# Altium schematic sheet 1_Sheet_1.schdoc.schdoc
size 302 x 215 mm; Name: A_A4; Symbol: A_A4; Device: A_A4; @Project Name: Arduino Spot welder_2024-04-27_21-11-09; REV: 1.0; Date: 2021-09-07; Sheet: 1/1; Draw By: Nischal Poudel; Company: Amateur Inventor; Convert to PCB: yes; Add into BOM: yes
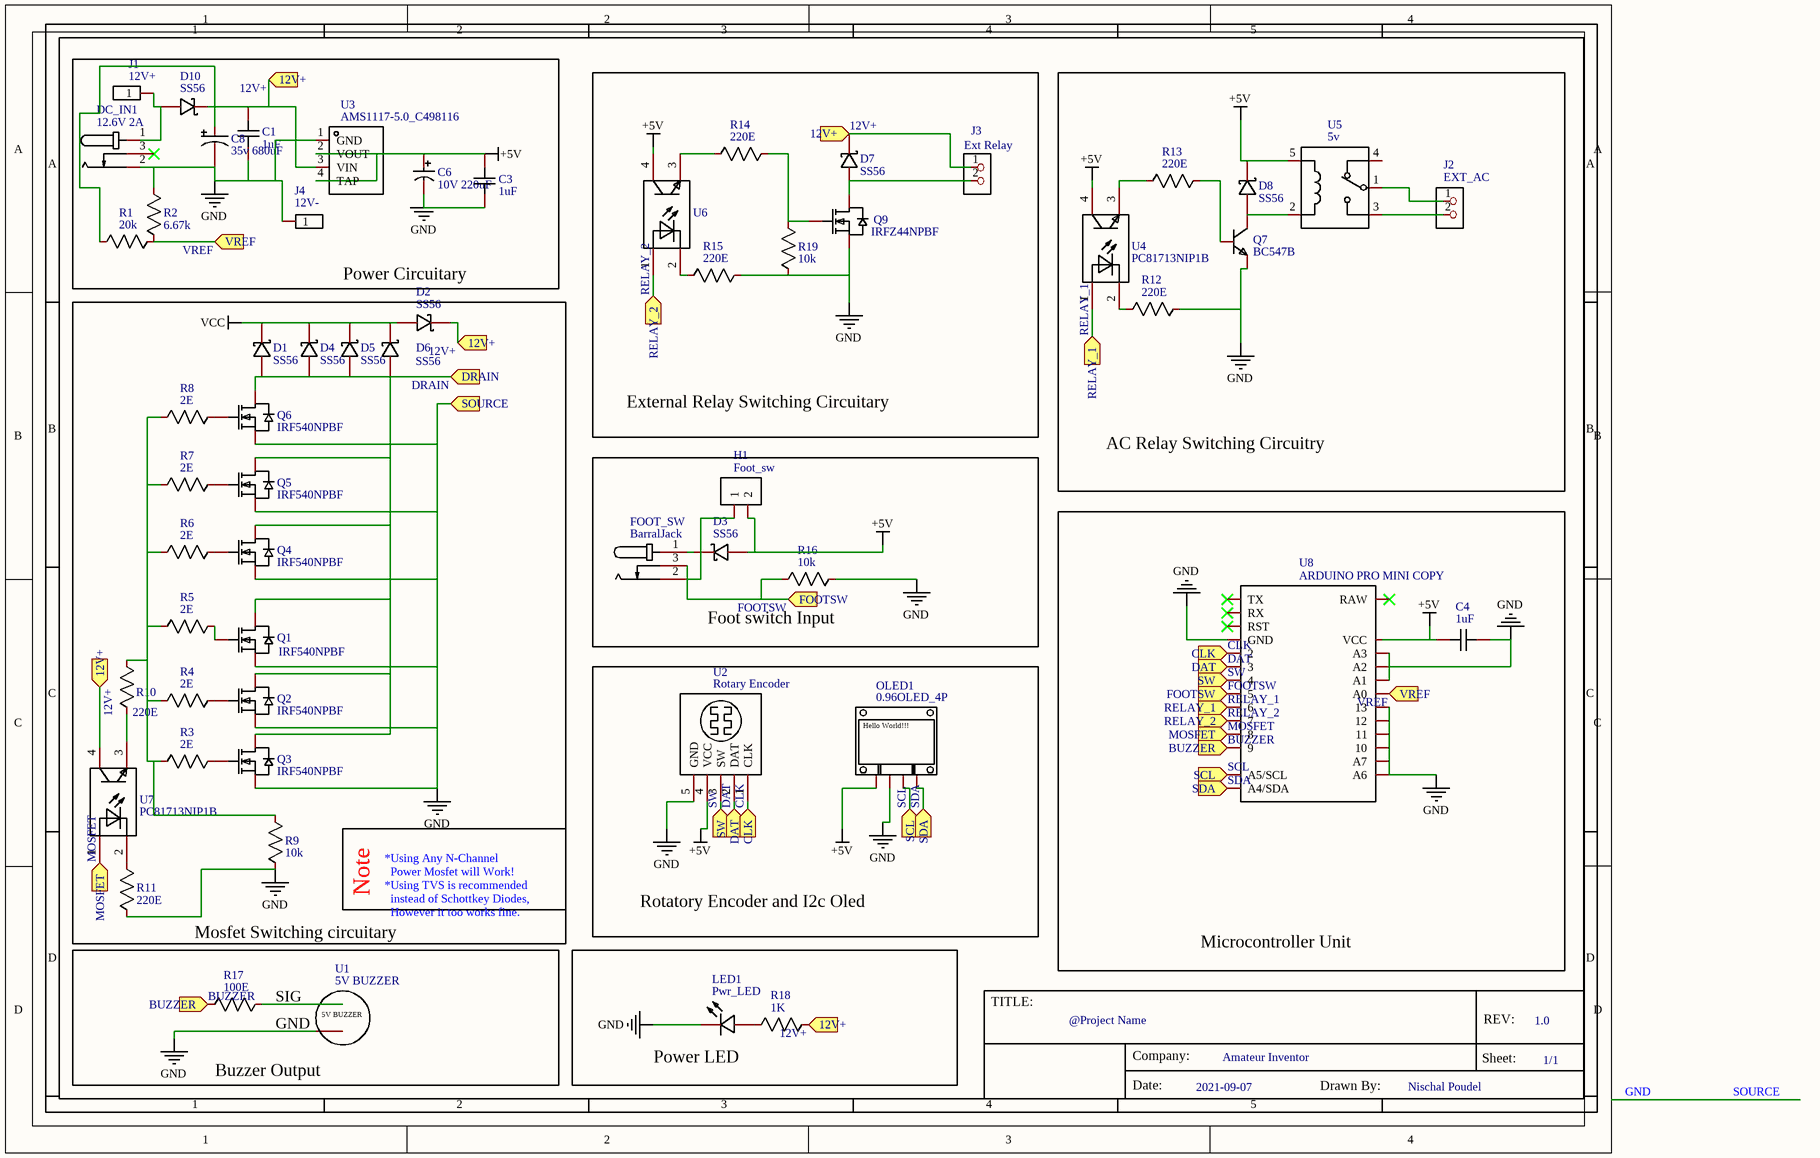
[diagram p0: 1_Sheet_1.schdoc.schdoc]

## Parts
C1  1uF  [footprint_bc1e]
C3  1uF  [footprint_bc1e]
C4  1uF  [footprint_bc1e]
C6  10V 220uF  [footprint_28fa]
C8  35v 680uF  [footprint_2c7b]
D1  SS56  [footprint_9b9f]
D2  SS56  [footprint_9b9f]
D3  SS56  [footprint_9b9f]
D4  SS56  [footprint_9b9f]
D5  SS56  [footprint_9b9f]
D6  SS56  [footprint_9b9f]
D7  SS56  [footprint_9b9f]
D8  SS56  [footprint_9b9f]
D10  SS56  [footprint_9b9f]
DC_IN1  12.6V 2A  [footprint_4f4c]
FOOT_SW  BarralJack  [footprint_4f4c]
H1  Foot_sw  [footprint_42ee]
J1  12V+  [footprint_73cd]
J2  EXT_AC  [footprint_047e]
J3  Ext Relay  [footprint_047e]
J4  12V-  [footprint_73cd]
LED1  Pwr_LED  [footprint_213e]
OLED1  0.96OLED_4P  [footprint_7381]
Q1  IRF540NPBF  [footprint_fbe3]
Q2  IRF540NPBF  [footprint_fbe3]
Q3  IRF540NPBF  [footprint_fbe3]
Q4  IRF540NPBF  [footprint_fbe3]
Q5  IRF540NPBF  [footprint_fbe3]
Q6  IRF540NPBF  [footprint_fbe3]
Q7  BC547B  [footprint_6e3f]
Q9  IRFZ44NPBF  [footprint_beaa]
R1  20k  [footprint_e60d]
R2  6.67k  [footprint_e60d]
R3  2E  [footprint_e60d]
R4  2E  [footprint_e60d]
R5  2E  [footprint_e60d]
R6  2E  [footprint_e60d]
R7  2E  [footprint_e60d]
R8  2E  [footprint_e60d]
R9  10k  [footprint_e60d]
R10  220E  [footprint_e60d]
R11  220E  [footprint_e60d]
R12  220E  [footprint_e60d]
R13  220E  [footprint_e60d]
R14  220E  [footprint_e60d]
R15  220E  [footprint_e60d]
R16  10k  [footprint_e60d]
R17  100E  [footprint_e60d]
R18  1K  [footprint_e60d]
R19  10k  [footprint_e60d]
U1  5V BUZZER  [footprint_9d75]
U2  Rotary Encoder  [footprint_7133]
U3  AMS1117-5.0_C498116  [footprint_729b]
U4  PC81713NIP1B  [footprint_04e3]
U5  5v  [footprint_572f]
U6  PC81713NIP1B  [footprint_04e3]  (value not drawn)
U7  PC81713NIP1B  [footprint_04e3]
U8  ARDUINO PRO MINI COPY  [footprint_e3e4]

## Ports
12V+ (in), BUZZER (in), CLK (in), DAT (in), DRAIN (in), FOOTSW (in), MOSFET (in), RELAY_1 (in), RELAY_2 (in), SCL (in), SDA (in), SOURCE (in), SW (in), VREF (in)

## Nets
+5V: C3.2 C4.2 C6.1 D3.2 D8.1 H1.2 OLED1.1 U2.4(VCC) U3.2(VOUT) U3.4(TAP) U4.4(Collector) U5.5 U6.4(Collector) U8.VCC
GND: C1.1 C3.1 C4.1 C6.2 C8.2 DC_IN1.2 J4.1 LED1.1(-) OLED1.2 Q1.3(S) Q2.3(S) Q3.3(S) Q4.3(S) Q5.3(S) Q6.3(S) Q7.3(E) Q9.3(S) R2.1 R9.1 R11.1 R12.1 R15.1 R16.1 R19.2 U2.5(GND) U3.1(GND) U8.A1 U8.A2 U8.A3 U8.A6 U8.A7 U8.D10(10) U8.D11(11) U8.D12(12) U8.D13(13) U8.GND ; port SOURCE  [also labelled SOURCE]
VCC: D1.1 D2.2 D4.1 D5.1 D6.1
12V+: C1.2 C8.1 D2.1 D7.1 D10.1 J3.1 R1.1 R18.1 U3.3(VIN) U7.4(Collector) ; port 12V+
BUZZER: R17.2 U8.D9(9) ; port BUZZER
CLK: U2.1(CLK) U8.D2(2) ; port CLK
DAT: U2.2(DAT) U8.D3(3) ; port DAT
DRAIN: D1.2 D4.2 D5.2 D6.2 Q1.2(D) Q2.2(D) Q3.2(D) Q4.2(D) Q5.2(D) Q6.2(D) ; port DRAIN
FOOTSW: FOOT_SW.2 FOOT_SW.3 H1.1 R16.2 U8.D5(5) ; port FOOTSW
MOSFET: U7.1(Anode) U8.D8(8) ; port MOSFET
RELAY_1: U4.1(Anode) U8.D6(6) ; port RELAY_1
RELAY_2: U6.1(Anode) U8.D7(7) ; port RELAY_2
SCL: OLED1.3 U8.A5(A5/SCL) ; port SCL
SDA: OLED1.4 U8.A4(A4/SDA) ; port SDA
SW: U2.3(SW) U8.D4(4) ; port SW
VREF: R1.2 R2.2 U8.A0 ; port VREF
NetD3_1: D3.1 FOOT_SW.1
NetD7_2: D7.2 J3.2 Q9.2(D)
NetD8_2: D8.2 Q7.1(C) U5.2
NetD10_2: D10.2 DC_IN1.1 J1.1
NetJ2_1: J2.1 U5.1
NetJ2_2: J2.2 U5.3
NetLED1_2: LED1.2(+) R18.2
NetQ1_1: Q1.1(G) R5.2
NetQ2_1: Q2.1(G) R4.2
NetQ3_1: Q3.1(G) R3.2
NetQ4_1: Q4.1(G) R6.2
NetQ5_1: Q5.1(G) R7.2
NetQ6_1: Q6.1(G) R8.2
NetQ7_2: Q7.2(B) R13.2
NetQ9_1: Q9.1(G) R14.2 R19.1
NetR3_1: R3.1 R4.1 R5.1 R6.1 R7.1 R8.1 R9.2 R10.2
NetR10_1: R10.1 U7.3(Emitter)
NetR11_2: R11.2 U7.2(Cathode)
NetR12_2: R12.2 U4.2(Cathode)
NetR13_1: R13.1 U4.3(Emitter)
NetR14_1: R14.1 U6.3(Emitter)
NetR15_2: R15.2 U6.2(Cathode)
NetR17_1: R17.1 U1.1

Not connected (* = marked no-connect by the designer): DC_IN1 3*; U1 2; U5 4; U8 RAW* RST* RX* TX*

## Notes on the sheet
- 1
- 2
- 3
- 4
- 5
- A
- B
- C
- D
- TITLE:
- @Project Name
- REV:
- 1.0
- Date:
- Company:
- 2021-09-07
- Amateur Inventor
- Drawn By:
- Nischal Poudel
- Sheet:
- 1/1
- (in symbol 0.96OLED_4P) Hello World!!!
- (in symbol 5V BUZZER) SIG; GND
- (in symbol ARDUINO PRO MINI COPY) Power Circuitary; External Relay Switching Circuitary; AC Relay Switching Circuitry; Foot switch Input; *Using Any N-Channel / Power Mosfet will Work!; *Using TVS is recommended / instead of Schottkey Diodes, / However it too works fine.; Note; Rotatory Encoder and I2c Oled; Mosfet Switching circuitary; Microcontroller Unit; Power LED; Buzzer Output

## Library data of the parts
C1 C3 C4 = 0603B105K160NT: Manufacturer: FH; Convert to PCB: yes; Origin Footprint: C0603; Name: 1uF; Symbol: 1uF; Device: 0603B105K160NT; Supplier: LCSC; Manufacturer Part: 0603B105K160NT; Supplier Part: C93816; Add into BOM: yes
C6 = 220uF 10V black gold 5*11: Manufacturer: ValuePro; Convert to PCB: yes; Origin Footprint: CAP-TH_BD5.0-P2.00-D0.8-FD; Name: 10V 220uF; Symbol: 10V 220uF; Device: 220uF 10V black gold 5*11; Supplier: LCSC; Manufacturer Part: 220uF 10V black gold 5*11; Supplier Part: C43355; JLCPCB Part Class: Extended Part; Add into BOM: yes
C8 = RC035M681LO10*16TH-2A1E: Manufacturer: BERYL Electronic Tech; Convert to PCB: yes; Origin Footprint: CAP-TH_BD10.0-P5.00-D1.0-FD; Name: 35v 680uF; Symbol: 35v 680uF; Device: RC035M681LO10*16TH-2A1E; Supplier: LCSC; Supplier Part: C357636; Manufacturer Part: RC035M681LO10*16TH-2A1E; JLCPCB Part Class: Extended Part; Add into BOM: yes
D1-D8 D10 = SS56: Manufacturer: High Diode; Convert to PCB: yes; Origin Footprint: SMA_L4.4-W2.6-LS5.0-RD; Name: SS56; Symbol: SS56; Device: SS56; Supplier: LCSC; Supplier Part: C466505; Manufacturer Part: SS56; Add into BOM: yes
DC_IN1 = DC-005B-2.5A-2.0: Manufacturer: XKB Enterprise; Convert to PCB: yes; Origin Footprint: DC-IN-TH_DC-005-20A; Name: 12.6V 2A; Symbol: 12.6V 2A; Device: DC-005B-2.5A-2.0; Supplier: LCSC; Supplier Part: C319132; Manufacturer Part: DC-005B-2.5A-2.0; JLCPCB Part Class: Extended Part; Add into BOM: yes
FOOT_SW = DC-005B-2.5A-2.0: Manufacturer: XKB Enterprise; Symbol: 12.6V 2A; Convert to PCB: yes; Origin Footprint: DC-IN-TH_DC-005-20A; Name: BarralJack; Device: DC-005B-2.5A-2.0; Supplier: LCSC; Supplier Part: C319132; Manufacturer Part: DC-005B-2.5A-2.0; JLCPCB Part Class: Extended Part; Add into BOM: yes
H1 = Foot_sw: Convert to PCB: yes; Origin Footprint: HDR-F-2.54_1X2; Name: Foot_sw; Symbol: Foot_sw; Device: Foot_sw; Supplier Part: C49661; Supplier: LCSC; Add into BOM: yes
J1 = 12V+: Convert to PCB: yes; Origin Footprint: HDR-M-2.54_1X1; Name: 12V+; Symbol: 12V+; Device: 12V+; Supplier Part: C81276; Supplier: LCSC; Add into BOM: yes
J2 = EXT_AC: Convert to PCB: yes; Origin Footprint: TERMINAL_BLOCK_2P_5; Name: EXT_AC; Symbol: EXT_AC; Device: EXT_AC; Add into BOM: yes
J3 = Ext Relay: Convert to PCB: yes; Origin Footprint: TERMINAL_BLOCK_2P_5; Name: Ext Relay; Symbol: Ext Relay; Device: Ext Relay; Add into BOM: yes
J4 = 12V-: Convert to PCB: yes; Origin Footprint: HDR-M-2.54_1X1; Name: 12V-; Symbol: 12V-; Device: 12V-; Supplier Part: C81276; Supplier: LCSC; Add into BOM: yes
LED1 = TJ-S1608SW6TGLC2G-A5: Manufacturer: TOGIALED; Convert to PCB: yes; Origin Footprint: LED0603-RD; Name: Pwr_LED; Symbol: Pwr_LED; Device: TJ-S1608SW6TGLC2G-A5; Supplier: LCSC; Supplier Part: C192316; Manufacturer Part: TJ-S1608SW6TGLC2G-A5; JLCPCB Part Class: Extended Part; Add into BOM: yes
OLED1 = 0.96OLED_4P: Convert to PCB: yes; Name: 0.96OLED_4P; Symbol: 0.96OLED_4P; Device: 0.96OLED_4P; Supplier: LCSC; Add into BOM: yes; Origin Footprint: 0.96OLED_4P
Q1-Q6 = IRF540NPBF: Manufacturer: Infineon; Convert to PCB: yes; Origin Footprint: TO-220-3_L10.0-W4.5-P2.54-L; Name: IRF540NPBF; Symbol: IRF540NPBF; Device: IRF540NPBF; Supplier: LCSC; Manufacturer Part: IRF540NPBF; Supplier Part: C2566; JLCPCB Part Class: Extended Part; Add into BOM: yes
Q7 = BC547B: Manufacturer: LGE; Convert to PCB: yes; Origin Footprint: TO-92-3_L4.9-W3.7-P1.27-L; Name: BC547B; Symbol: BC547B; Device: BC547B; Supplier: LCSC; Supplier Part: C713613; Manufacturer Part: BC547B; JLCPCB Part Class: Extended Part; Add into BOM: yes
Q9 = IRFZ44NPBF: Manufacturer: Infineon(英飞凌); Convert to PCB: yes; Origin Footprint: TO-220-3_L10.0-W4.5-P2.54-L; Name: IRFZ44NPBF; Symbol: IRFZ44NPBF; Device: IRFZ44NPBF; Supplier: LCSC; Manufacturer Part: IRFZ44NPBF; Supplier Part: C2586; JLCPCB Part Class: Extended Part; Add into BOM: yes
R1 = 20k: Convert to PCB: yes; Origin Footprint: R0603; Name: 20k; Symbol: 20k; Device: 20k; Add into BOM: yes
R2 = 6.67k: Convert to PCB: yes; Origin Footprint: R0603; Name: 6.67k; Symbol: 6.67k; Device: 6.67k; Add into BOM: yes
R3-R8 = 2E: Convert to PCB: yes; Origin Footprint: R0603; Name: 2E; Symbol: 2E; Device: 2E; Add into BOM: yes
R9 R16 R19 = 10k: Convert to PCB: yes; Origin Footprint: R0603; Name: 10k; Symbol: 10k; Device: 10k; Add into BOM: yes
R10-R15 = 220E: Convert to PCB: yes; Origin Footprint: R0603; Name: 220E; Symbol: 220E; Device: 220E; Add into BOM: yes
R17 = 100E: Convert to PCB: yes; Origin Footprint: R0603; Name: 100E; Symbol: 100E; Device: 100E; Add into BOM: yes
R18 = 1K: Convert to PCB: yes; Origin Footprint: R0603; Name: 1K; Symbol: 1K; Device: 1K; Add into BOM: yes
U1 = 5V BUZZER: Convert to PCB: yes; Name: 5V BUZZER; Symbol: 5V BUZZER; Device: 5V BUZZER; Add into BOM: yes; Origin Footprint: 5V BUZZER
U2 = encoder: Convert to PCB: yes; Name: Rotary Encoder; Symbol: Rotary Encoder; Device: encoder; Manufacturer Part: encoder; Add into BOM: yes; Origin Footprint: ROTARY ENCODER
U3 = AMS1117-5.0: Manufacturer: HGC(Huaguan Semicon); Convert to PCB: yes; Origin Footprint: PG-SOT223-4_L6.5-W3.5-P2.30-LS7.0-BR; Name: AMS1117-5.0_C498116; Symbol: AMS1117-5.0_C498116; Device: AMS1117-5.0; Supplier: LCSC; Supplier Part: C498116; Manufacturer Part: AMS1117-5.0; JLCPCB Part Class: Extended Part; Add into BOM: yes
U4 U6 U7 = PC81713NIP1B: Manufacturer: Sharp Microelectronics; Convert to PCB: yes; Origin Footprint: SOP-4_L6.5-W4.6-P2.54-LS10.2-BL; Name: PC81713NIP1B; Symbol: PC81713NIP1B; Device: PC81713NIP1B; Supplier: LCSC; Supplier Part: C390732; Manufacturer Part: PC81713NIP1B; Add into BOM: yes
U5 = 5v: Convert to PCB: yes; Origin Footprint: RELAY 12V; Name: 5v; Symbol: 5v; Device: 5v; Add into BOM: yes
U8 = ARDUINO PRO MINI COPY: Description: Arduino Pro Mini footprint; Convert to PCB: yes; Origin Footprint: ARDUINOPROMINI_ARDUINO_PRO_MINI; Name: ARDUINO PRO MINI COPY; Symbol: ARDUINO PRO MINI COPY; Device: ARDUINO PRO MINI COPY; Add into BOM: yes